# Altium schematic sheet 步进电机（单）.SchDoc
size A4
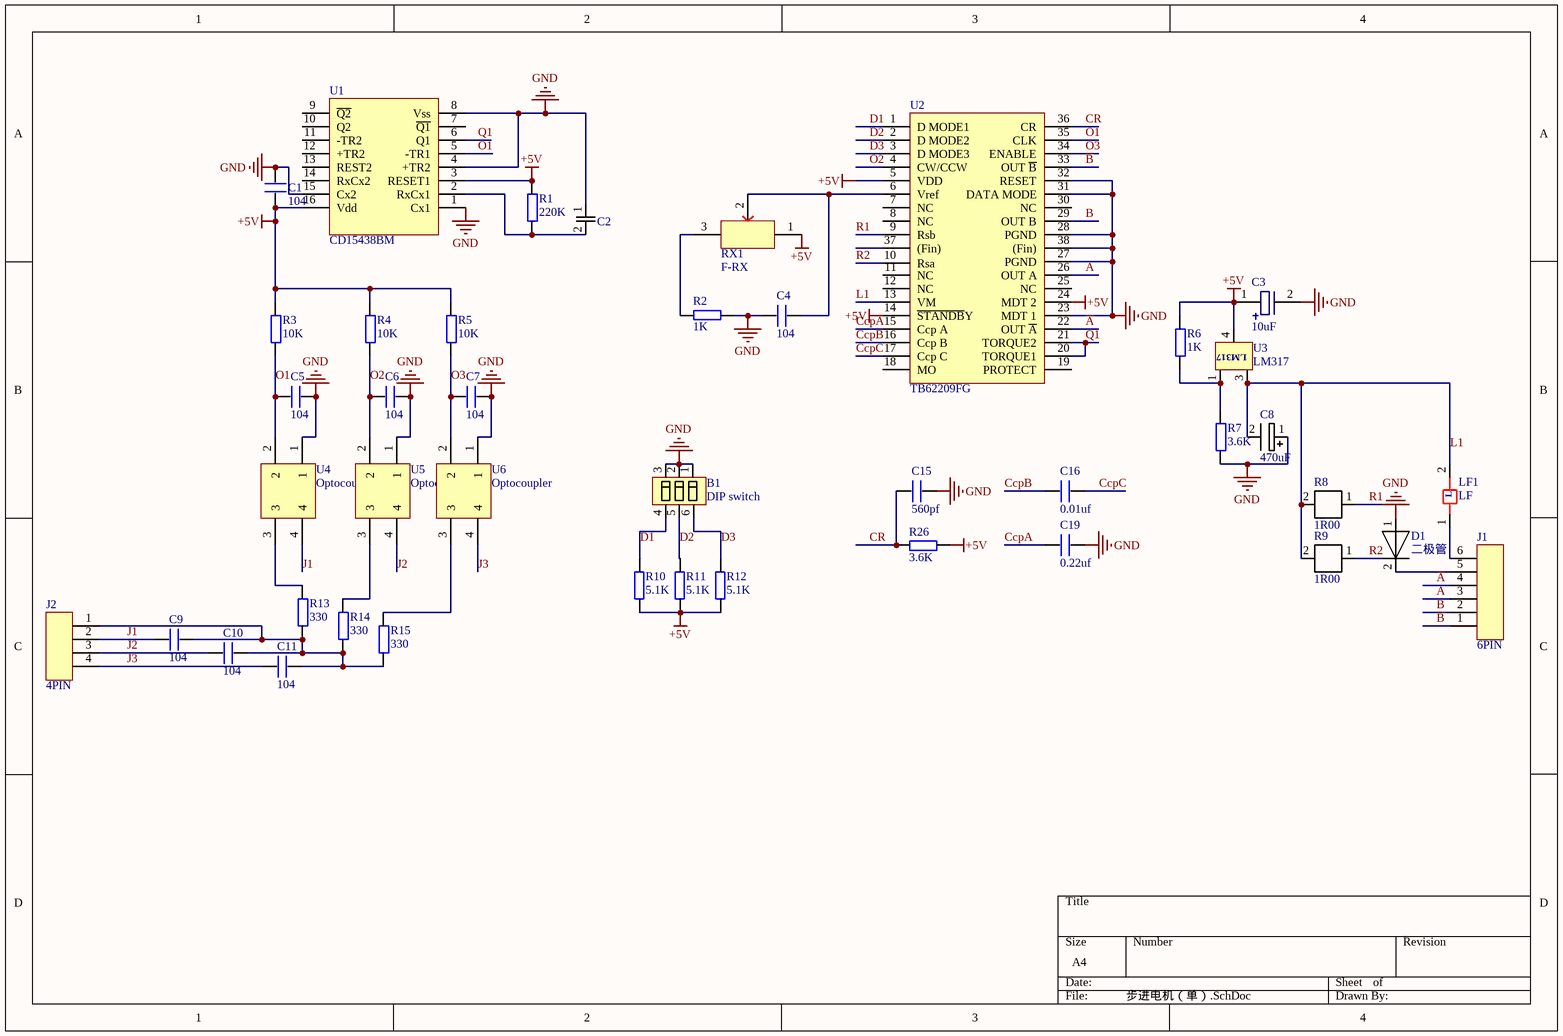
[diagram p0: 步进电机（单）.SchDoc]

## Parts
B1  DIP switch  [拨码开关-3]
C1  104  [0603P]
C2  SOP-CAP  [0805]  (value not drawn)
C3  10uF  [CAP]
C4  104  [0603P]
C5  104  [0603P]
C6  104  [0603P]
C7  104  [0603P]
C8  470uF  [470uF CAP]
C9  104  [0603P]
C10  104  [0603P]
C11  104  [0603P]
C15  560pf  [0603P]
C16  0.01uf  [0603P]
C19  0.22uf  [0603P]
D1  二极管  [二极管]
J1  6PIN  [6PIN]
J2  4PIN  [4PIN]
LF1  LF  [LF]
R1  value 220K  [0603P]  (hidden comment: 22R)
R2  value 1K  [0603P]  (hidden comment: 22R)
R3  value 10K  [0603P]  (hidden comment: 22R)
R4  value 10K  [0603P]  (hidden comment: 22R)
R5  value 10K  [0603P]  (hidden comment: 22R)
R6  value 1K  [0603P]  (hidden comment: 22R)
R7  value 3.6K  [0603P]  (hidden comment: 22R)
R8  1R00  [1R00]
R9  1R00  [1R00]
R10  value 5.1K  [0603P]  (hidden comment: 22R)
R11  value 5.1K  [0603P]  (hidden comment: 22R)
R12  value 5.1K  [0603P]  (hidden comment: 22R)
R13  value 330  [0603P]  (hidden comment: 22R)
R14  value 330  [0603P]  (hidden comment: 22R)
R15  value 330  [0603P]  (hidden comment: 22R)
R26  value 3.6K  [0603P]  (hidden comment: 22R)
RX1  F-RX  [F-RX]
U1  CD15438BM  [CD14538BM]
U2  TB62209FG  [TB62209FG]
U3  LM317  [LM317-SOP]
U4  Optocoupler  [光耦]
U5  Optocoupler  [光耦]
U6  Optocoupler  [光耦]

## Nets
+5V: C1.1 C3.1 R1.2 R3.2 R4.2 R5.2 R6.2 R10.2 R11.2 R12.2 R26.2 RX1.1 U1.3(RESET1) U1.16(Vdd) U2.5(VDD) U2.14(~{STANDB}Y) U2.24(MDT_2) U3.4
GND: B1.1 B1.2 B1.3 C1.2 C2.1 C3.2 C4.1 C5.2 C6.2 C7.2 C8.1 C15.2 C19.2 D1.1 R2.1 R7.1 U1.1(Cx1) U1.4(+TR2) U1.8(Vss) U1.15(Cx2) U2.23(MDT_1) U2.27(PGND) U2.28(PGND) U2.31(DATA_MODE) U2.32(RESET) U2.38((Fin)) U4.1 U5.1 U6.1
A: J1.3 U2.26(OUT_A)
~{A}: J1.4 U2.22(OUT_~{A})
B: J1.2 U2.29(OUT_B)
~{B}: J1.1 U2.33(OUT_~{B})
CcpA: C19.1 U2.15(Ccp_A)
CcpB: C16.1 U2.16(Ccp_B)
CcpC: C16.2 U2.17(Ccp_C)
CR: C15.1 R26.1 U2.36(CR)
D1: B1.4 R10.1 U2.1(D_MODE1)
D2: B1.5 R11.1 U2.2(D_MODE2)
D3: B1.6 R12.1 U2.3(D_MODE3)
J1: C9.1 J2.2 U4.4
J2: C10.1 J2.3 U5.4
J3: C11.1 J2.4 U6.4
L1: C8.2 LF1.2 R8.2 R9.2 U2.13(VM) U3.3
O1: C5.1 R3.1 U1.5(-TR1) U2.35(CLK) U4.2
O2: C6.1 R4.1 U2.4(CW/CCW) U5.2
O3: C7.1 R5.1 U2.34(ENABLE) U6.2
Q1: U1.6(Q1) U2.20(TORQUE1) U2.21(TORQUE2)
R1: R8.1 U2.9(Rsb)
R2: R9.1 U2.10(Rsa)
NetC2_2: C2.2 R1.1 U1.2(RxCx1)
NetC4_2: C4.2 RX1.2 U2.6(Vref)
NetC9_2: C9.2 C10.2 C11.2 J2.1 R13.1 R14.1 R15.1
NetD1_2: D1.2 J1.5
NetJ1_6: J1.6 LF1.1
NetR2_2: R2.2 RX1.3
NetR6_1: R6.1 R7.2 U3.1
NetR13_2: R13.2 U4.3
NetR14_2: R14.2 U5.3
NetR15_2: R15.2 U6.3

Not connected (* = marked no-connect by the designer): U1 7(~{Q1}) 9(~{Q2}) 10(Q2) 11(-TR2) 12(+TR2) 13(REST2) 14(RxCx2); U2 7(NC) 8(NC) 11(NC) 12(NC) 18(MO) 19(PROTECT) 25(NC) 30(NC) 37((Fin))

## Notes on the sheet
- (in symbol LF) L

## Library data of the parts
B1 = 拨�
C1 C4-C7 C9-C11 C15 C16 C19 = C
C3 = cap10uF
D1 = ¶
R1-R7 R10-R15 R26 = R
U4-U6 = ¹
C2 = SOP-CAP: Value: *